# Altium schematic sheet PAGE01_项目历史.SchDoc
size A4
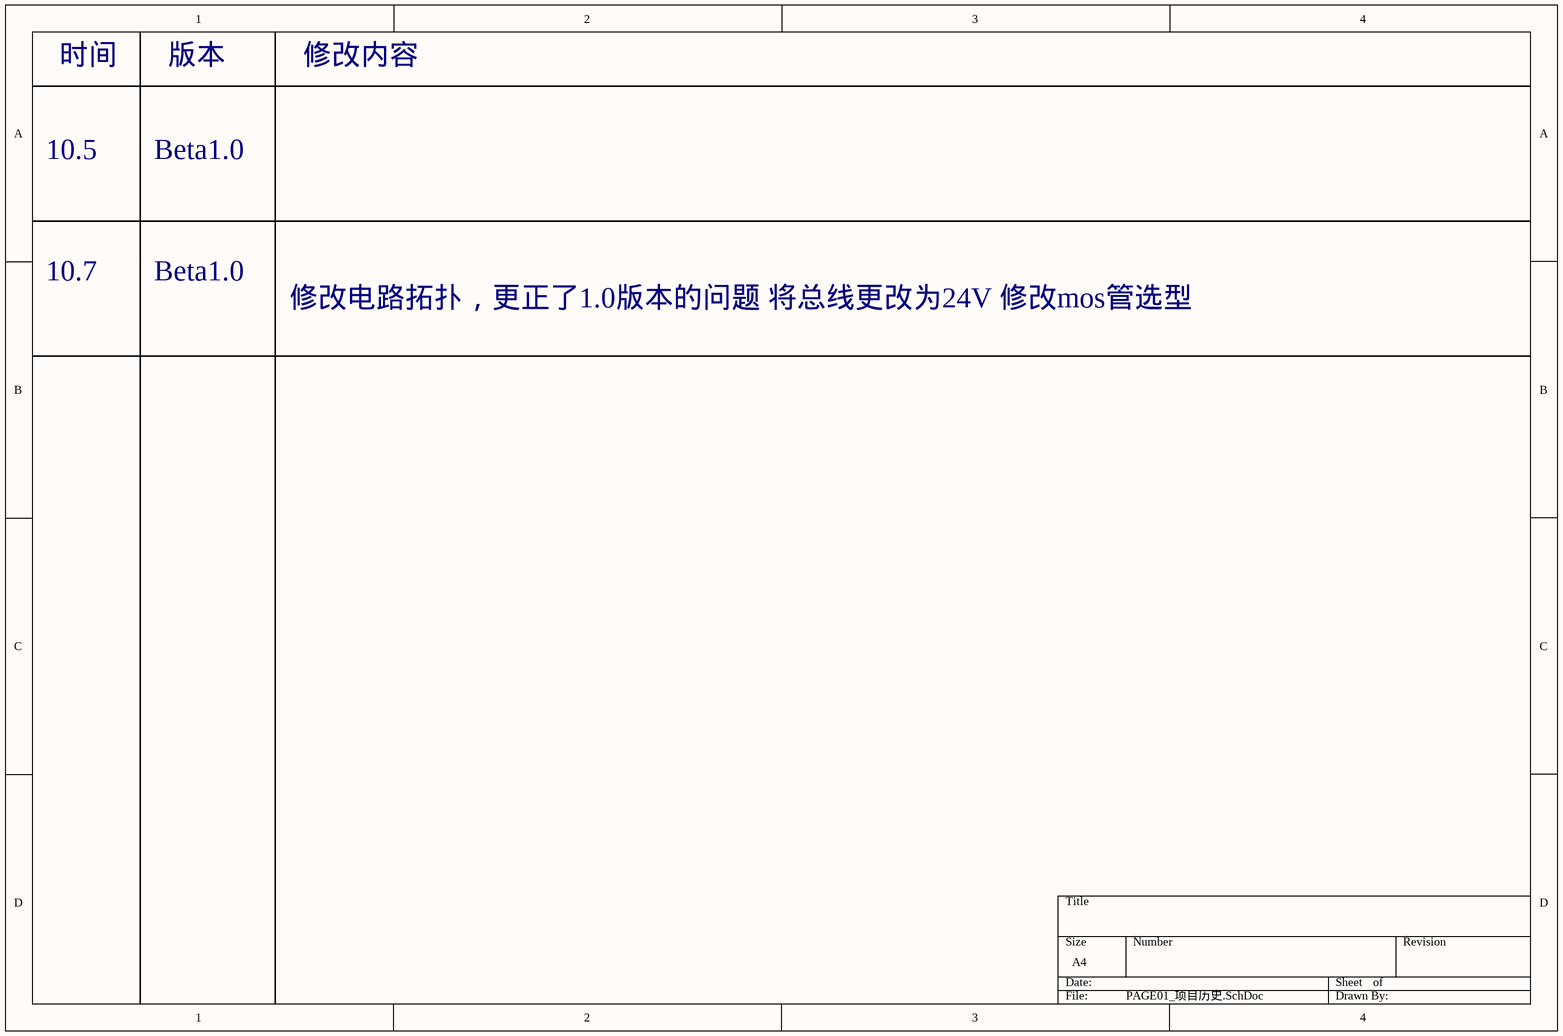
[diagram p0: PAGE01_项目历史.SchDoc]

## Notes on the sheet
- 时间
- 版本
- 修改内容
- 10.5
- Beta1.0
- 10.7
- 修改电路拓扑，更正了1.0版本的问题 将总线更改为24V 修改mos管选型